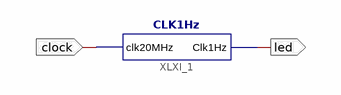
[diagram p0: schematic sheet 1]
// Xilinx ISE schematic testClock.sch (spartan6) as structural Verilog: 1 symbols, 2 ports
module testClock (
  input  clock,
  output led
);

  CLK1Hz XLXI_1 (.Clk1Hz(led), .clk20MHz(clock));
endmodule
